# Altium schematic sheet relays.SchDoc
size A4
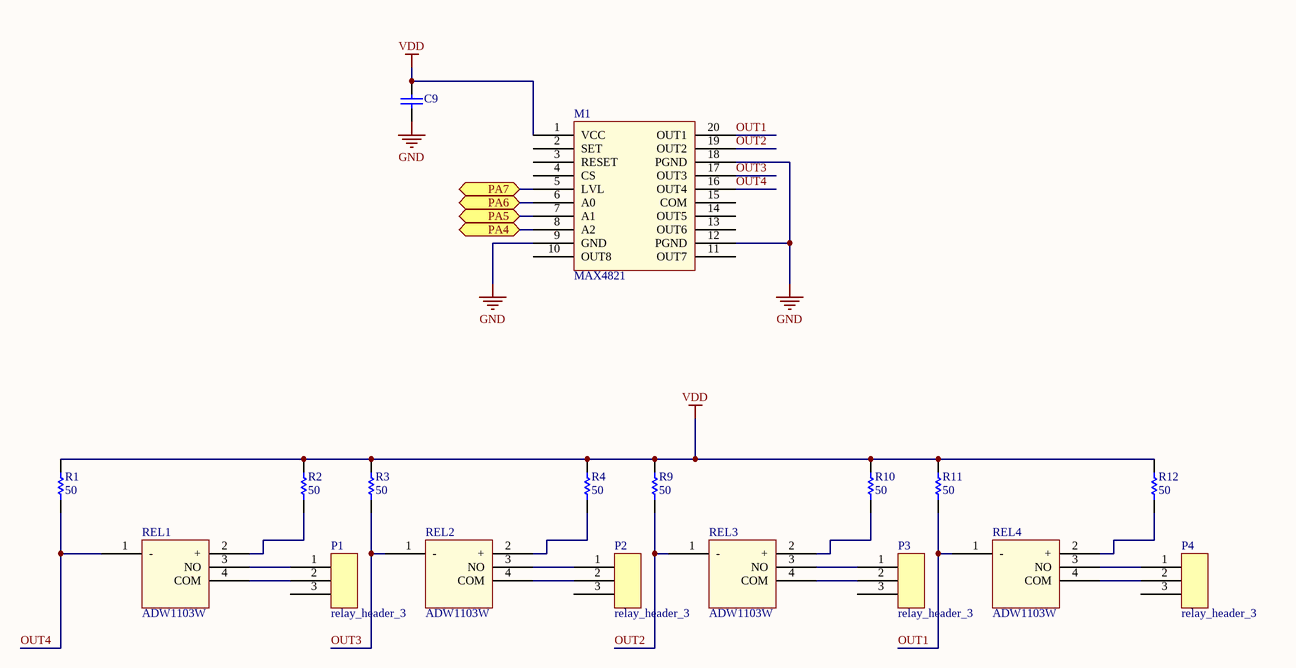
[diagram p0: relays.SchDoc]

## Parts
C9  Cap Semi  [1608[0603]]  (value not drawn)
M1  MAX4821  [MAX4821]
P1  relay_header_3  [ac_header_3]
P2  relay_header_3  [ac_header_3]
P3  relay_header_3  [ac_header_3]
P4  relay_header_3  [ac_header_3]
R1  50  [0603R]
R2  50  [0603R]
R3  50  [0603R]
R4  50  [0603R]
R9  50  [0603R]
R10  50  [0603R]
R11  50  [0603R]
R12  50  [0603R]
REL1  ADW1103W  [ADW1103W]
REL2  ADW1103W  [ADW1103W]
REL3  ADW1103W  [ADW1103W]
REL4  ADW1103W  [ADW1103W]

## Ports
PA4, PA5, PA6, PA7

## Nets
GND: C9.2 M1.9(GND) M1.12(PGND) M1.18(PGND)
VDD: C9.1 M1.1(VCC) R1.1 R2.1 R3.1 R4.1 R9.1 R10.1 R11.1 R12.1
OUT1: M1.20(OUT1) R11.2 REL4.1(-)
OUT2: M1.19(OUT2) R9.2 REL3.1(-)
OUT3: M1.17(OUT3) R3.2 REL2.1(-)
OUT4: M1.16(OUT4) R1.2 REL1.1(-)
PA4: M1.8(A2) ; port PA4
PA5: M1.7(A1) ; port PA5
PA6: M1.6(A0) ; port PA6
PA7: M1.5(LVL) ; port PA7
NetP1_1: P1.1 REL1.3(NO)
NetP1_2: P1.2 REL1.4(COM)
NetP2_1: P2.1 REL2.3(NO)
NetP2_2: P2.2 REL2.4(COM)
NetP3_1: P3.1 REL3.3(NO)
NetP3_2: P3.2 REL3.4(COM)
NetP4_1: P4.1 REL4.3(NO)
NetP4_2: P4.2 REL4.4(COM)
NetR2_2: R2.2 REL1.2(+)
NetR4_2: R4.2 REL2.2(+)
NetR10_2: R10.2 REL3.2(+)
NetR12_2: R12.2 REL4.2(+)

Not connected (* = marked no-connect by the designer): M1 2(SET) 3(RESET) 4(CS) 10(OUT8) 11(OUT7) 13(OUT6) 14(OUT5) 15(COM); P1 3; P2 3; P3 3; P4 3

## Library data of the parts
C9 = Cap Semi: Capacitor (Semiconductor SIM Model); Manufacturer: TDK; ProductNumber: C1608X5R1H104K080AA; Vendor Name: Digikey; Published: 8-Jun-2000; LatestRevisionDate: 29-May-2009; LatestRevisionNote: IPC-7351 Footprint Added.; PackageReference: C1206; Publisher: Altium Limited; PackageDescription: Chip Capacitor
M1 = MAX4821: Manufacturer: Maxim Integrated; ProductNumber: MAX4821EUP+; Vendor Name: Digikey; Vendor PN: MAX4821EUP+-ND; Price: 2,59; Stock: 2.209
P1 = relay_header_3: Manufacturer: On Shore Technology; ProductNumber: OSTTC032162; Vendor Name: Digikey; Vendor PN: ED2610-ND; Price: 0,85; Stock: 17.309
P2-P4 = relay_header_3: Manufacturer: On Shore Technology; ProductNumber: OSTTC032162; Vendor Name: Digikey
R1 = Res1: Resistor; Manufacturer: Vishay Dale; Value: 50 Ohms; ProductNumber: CRCW060350R0FKEA; Vendor Name: Farnell; Vendor PN: 2112878; Published: 8-Jun-2000; Revision: July-2002: Re-released for DXP Platform.; Publisher: Altium Limited; Price: 0.0169; Stock: 12,926
R2-R4 R9-R12 = Res1: Resistor; Manufacturer: Vishay Dale; ProductNumber: CRCW060350R0FKEA; Vendor Name: Digikey; Published: 8-Jun-2000; Revision: July-2002: Re-released for DXP Platform.; Publisher: Altium Limited
REL1 = ADW1103W: Manufacturer: Panasonic; Vendor Name: Mouser; Vendor PN: 769-ADW1103TW; ProductNumber: ADW1103W; Price: 6,21; Stock: 85
REL2-REL4 = ADW1103W: Manufacturer: Panasonic; Vendor Name: Digikey; ProductNumber: ADW1103W